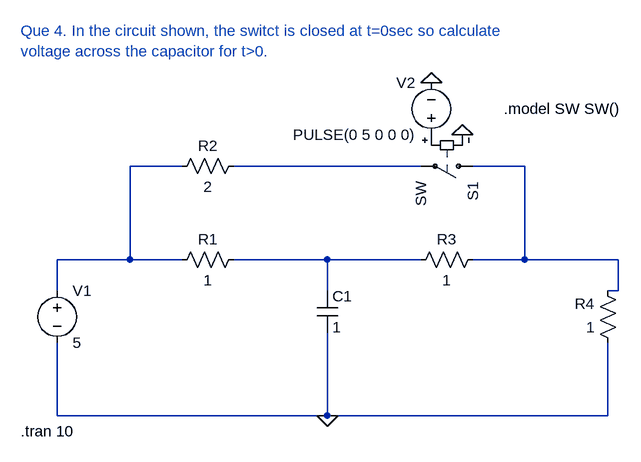
[diagram p0: schematic 4_Dheerendra_23EE019_Transient.asc]
4_Dheerendra_23EE019_Transient.asc, the LTspice schematic file:
Version 4
SHEET 1 880 680
WIRE 128 240 48 240
WIRE 496 240 208 240
WIRE 656 240 576 240
WIRE 48 384 48 240
WIRE 48 384 -64 384
WIRE 128 384 48 384
WIRE 352 384 208 384
WIRE 496 384 352 384
WIRE 656 384 656 240
WIRE 656 384 576 384
WIRE 800 384 656 384
WIRE -64 432 -64 384
WIRE 352 432 352 384
WIRE 800 432 800 384
WIRE 800 432 784 432
WIRE -64 624 -64 512
WIRE 352 624 352 496
WIRE 352 624 -64 624
WIRE 784 624 784 512
WIRE 784 624 352 624
FLAG 560 192 0
FLAG 512 112 0
FLAG 352 624 0
SYMBOL voltage -64 416 R0
WINDOW 123 0 0 Left 0
WINDOW 39 0 0 Left 0
SYMATTR InstName V1
SYMATTR Value 5
SYMBOL res 224 368 R90
WINDOW 0 0 56 VBottom 2
WINDOW 3 32 56 VTop 2
SYMATTR InstName R1
SYMATTR Value 1
SYMBOL res 224 224 R90
WINDOW 0 0 56 VBottom 2
WINDOW 3 32 56 VTop 2
SYMATTR InstName R2
SYMATTR Value 2
SYMBOL res 592 368 R90
WINDOW 0 0 56 VBottom 2
WINDOW 3 32 56 VTop 2
SYMATTR InstName R3
SYMATTR Value 1
SYMBOL res 800 528 R180
WINDOW 0 36 76 Left 2
WINDOW 3 36 40 Left 2
SYMATTR InstName R4
SYMATTR Value 1
SYMBOL cap 336 432 R0
SYMATTR InstName C1
SYMATTR Value 1
SYMBOL sw 592 240 R90
SYMATTR InstName S1
SYMBOL voltage 512 208 R180
WINDOW 0 24 96 Left 2
WINDOW 3 24 16 Left 2
WINDOW 123 0 0 Left 0
WINDOW 39 0 0 Left 0
SYMATTR InstName V2
SYMATTR Value PULSE(0 5 0 0 0)
TEXT -120 32 Left 2 ;Que 4. In the circuit shown, the switct is closed at t=0sec so calculate \nvoltage across the capacitor for t>0.
TEXT 624 152 Left 2 !.model SW SW()
TEXT -120 648 Left 2 !.tran 10

The netlist it stands for:
* 4_Dheerendra_23EE019_Transient.asc
V1 N001 0 5
R1 N004 N001 1
R2 N002 N001 2
R3 N003 N004 1
R4 0 N003 1
C1 N004 0 1
S1 N003 N002 P001 0 SW
V2 P001 0 PULSE(0 5 0 0 0)
* Que 4. In the circuit shown, the switct is closed at t=0sec so calculate
* voltage across the capacitor for t>0.
.model SW SW()
.tran 10
.backanno
.end